# Altium project MainBoard.PrjPCB
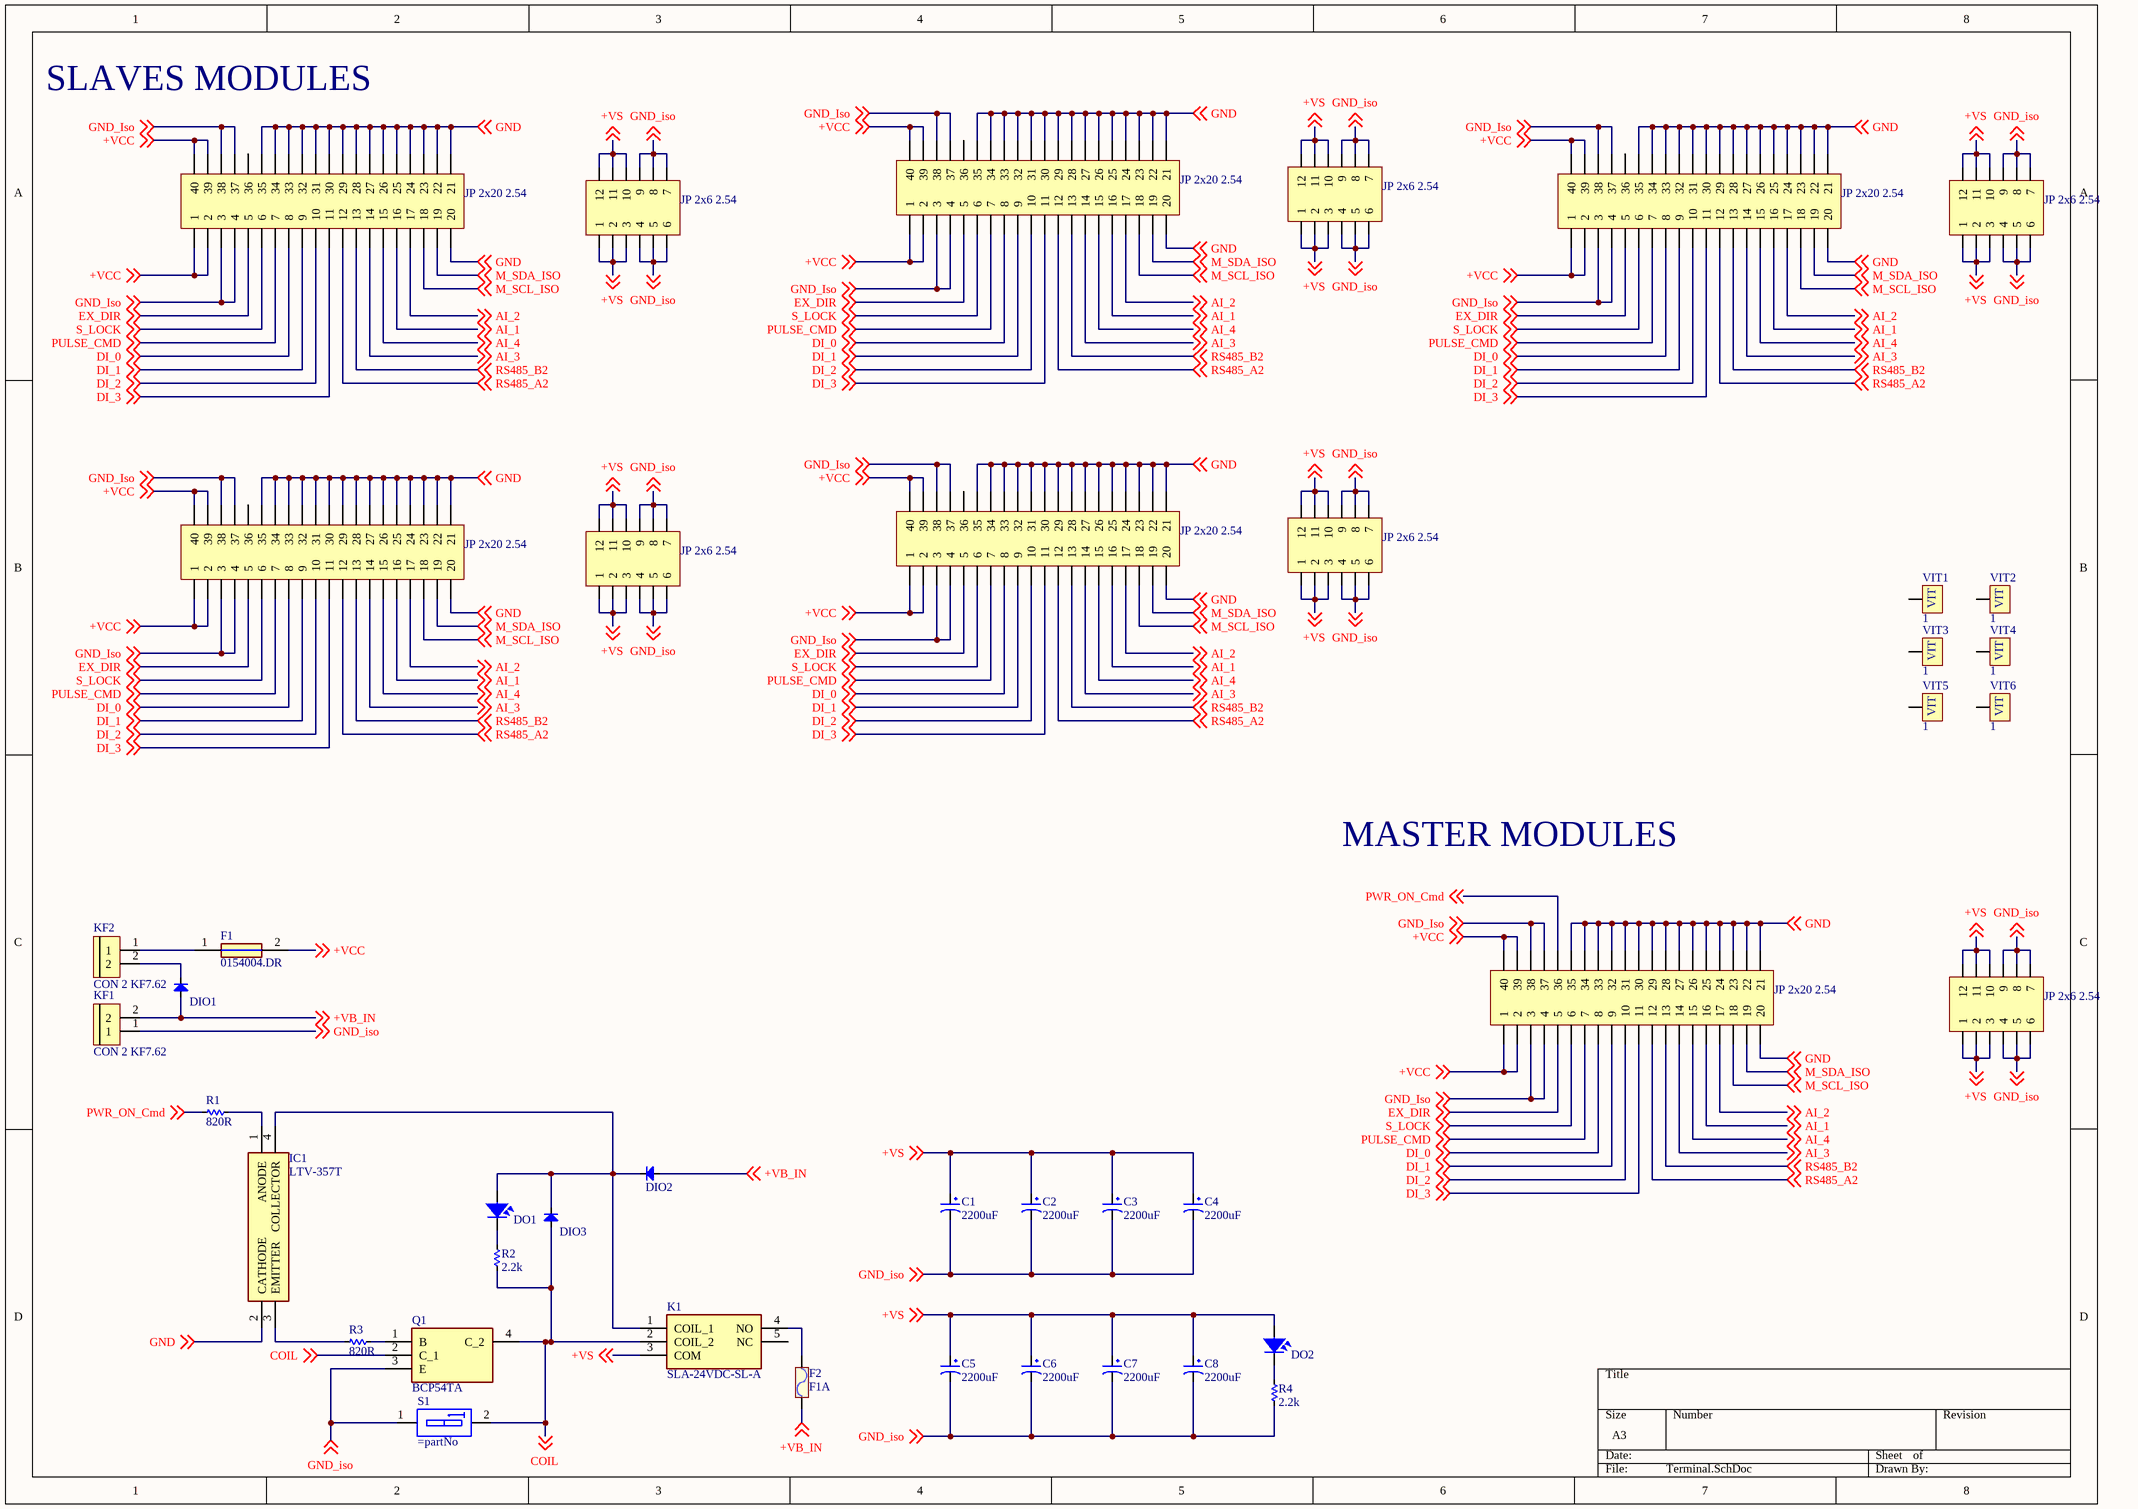
[diagram p0: Terminal.SchDoc]
1 sheet, 43 parts. Net scope: global (net labels, ports and power ports of the same name join across sheets).
Board file: PCB_Mainboard.PcbDoc

## Sheet Terminal.SchDoc
size A3

### Parts
C1  2200uF  [tu hoa 16mm]
C2  2200uF  [tu hoa 16mm]
C3  2200uF  [tu hoa 16mm]
C4  2200uF  [tu hoa 16mm]
C5  2200uF  [tu hoa 16mm]
C6  2200uF  [tu hoa 16mm]
C7  2200uF  [tu hoa 16mm]
C8  2200uF  [tu hoa 16mm]
DIO1  Diode SMD  [DIO-SMD-106]  (value not drawn)
DIO2  Diode SMD  [DIO-SMD-106]  (value not drawn)
DIO3  Diode SMD  [DIO-SMD-106]  (value not drawn)
DO1  LED  [LED-0805-Yellow]  (value not drawn)
DO2  LED  [LED-0805-Yellow]  (value not drawn)
F1  0154004.DR  [0154001.DRT]
F2  F1A  [Fuse1]
IC1  LTV-357T  [LTV-357T]
JP1  JP 2x20 2.54  [JP 2x20 CT]
JP2  JP 2x6 2.54  [JP 2x6 CT]
JP3  JP 2x20 2.54  [JP 2x20 CT]
JP4  JP 2x6 2.54  [JP 2x6 CT]
JP5  JP 2x20 2.54  [JP 2x20 CT]
JP6  JP 2x6 2.54  [JP 2x6 CT]
JP7  JP 2x20 2.54  [JP 2x20 CT]
JP9  JP 2x20 2.54  [JP 2x20 CT]
JP10  JP 2x6 2.54  [JP 2x6 CT]
JP11  JP 2x20 2.54  [JP 2x20 CT]
JP12  JP 2x6 2.54  [JP 2x6 CT]
JP?  JP 2x6 2.54  [JP 2x6 CT]
K1  SLA-24VDC-SL-A  [SLA24VDCSLA]
KF1  CON 2 KF7.62  [CON 2 KF7.62]
KF2  CON 2 KF7.62  [CON 2 KF7.62]
Q1  BCP54TA  [SOT230P700X165-4N]
R1  820R  [RES-SMD-0805]
R2  2.2k  [RES-SMD-0805]
R3  820R  [RES-SMD-0805]
R4  2.2k  [RES-SMD-0805]
S1  (no value)  [SW-DIP1-1]
VIT1  1  [VIT]
VIT2  1  [VIT]
VIT3  1  [VIT]
VIT4  1  [VIT]
VIT5  1  [VIT]
VIT6  1  [VIT]

### Nets
+VB_IN: DIO1.1(A) DIO2.1(A) F2.1 KF1.2 ; off-sheet +VB_IN
+VCC: F1.2 JP1.1 JP1.2 JP1.39 JP1.40 JP3.1 JP3.2 JP3.39 JP3.40 JP5.1 JP5.2 JP5.39 JP5.40 JP7.1 JP7.2 JP7.39 JP7.40 JP9.1 JP9.2 JP9.39 JP9.40 JP11.1 JP11.2 JP11.39 JP11.40 ; off-sheet +VCC
+VS: C1.1 C2.1 C3.1 C4.1 C5.1 C6.1 C7.1 C8.1 DO2.1 JP2.1 JP2.2 JP2.3 JP2.10 JP2.11 JP2.12 JP4.1 JP4.2 JP4.3 JP4.10 JP4.11 JP4.12 JP6.1 JP6.2 JP6.3 JP6.10 JP6.11 JP6.12 JP10.1 JP10.2 JP10.3 JP10.10 JP10.11 JP10.12 JP12.1 JP12.2 JP12.3 JP12.10 JP12.11 JP12.12 JP?.1 JP?.2 JP?.3 JP?.10 JP?.11 JP?.12 K1.3(COM) ; off-sheet +VS
AI_1: JP1.16 JP3.16 JP5.16 JP7.16 JP9.16 JP11.16 ; off-sheet AI_1
AI_2: JP1.17 JP3.17 JP5.17 JP7.17 JP9.17 JP11.17 ; off-sheet AI_2
AI_3: JP1.14 JP3.14 JP5.14 JP7.14 JP9.14 JP11.14 ; off-sheet AI_3
AI_4: JP1.15 JP3.15 JP5.15 JP7.15 JP9.15 JP11.15 ; off-sheet AI_4
COIL: DIO3.1(A) K1.2(COIL_2) Q1.2(C_1) Q1.4(C_2) R2.2 S1.2 ; off-sheet COIL
DI_0: JP1.8 JP3.8 JP5.8 JP7.8 JP9.8 JP11.8 ; off-sheet DI_0
DI_1: JP1.9 JP3.9 JP5.9 JP7.9 JP9.9 JP11.9 ; off-sheet DI_1
DI_2: JP1.10 JP3.10 JP5.10 JP7.10 JP9.10 JP11.10 ; off-sheet DI_2
DI_3: JP1.11 JP3.11 JP5.11 JP7.11 JP9.11 JP11.11 ; off-sheet DI_3
EX_DIR: JP1.5 JP3.5 JP5.5 JP7.5 JP9.5 JP11.5 ; off-sheet EX_DIR
GND: IC1.2(CATHODE) JP1.20 JP1.21 JP1.22 JP1.23 JP1.24 JP1.25 JP1.26 JP1.27 JP1.28 JP1.29 JP1.30 JP1.31 JP1.32 JP1.33 JP1.34 JP1.35 JP3.20 JP3.21 JP3.22 JP3.23 JP3.24 JP3.25 JP3.26 JP3.27 JP3.28 JP3.29 JP3.30 JP3.31 JP3.32 JP3.33 JP3.34 JP3.35 JP5.20 JP5.21 JP5.22 JP5.23 JP5.24 JP5.25 JP5.26 JP5.27 JP5.28 JP5.29 JP5.30 JP5.31 JP5.32 JP5.33 JP5.34 JP5.35 JP7.20 JP7.21 JP7.22 JP7.23 JP7.24 JP7.25 JP7.26 JP7.27 JP7.28 JP7.29 JP7.30 JP7.31 JP7.32 JP7.33 JP7.34 JP7.35 JP9.20 JP9.21 JP9.22 JP9.23 JP9.24 JP9.25 JP9.26 JP9.27 JP9.28 JP9.29 JP9.30 JP9.31 JP9.32 JP9.33 JP9.34 JP9.35 JP11.20 JP11.21 JP11.22 JP11.23 JP11.24 JP11.25 JP11.26 JP11.27 JP11.28 JP11.29 JP11.30 JP11.31 JP11.32 JP11.33 JP11.34 JP11.35 ; off-sheet GND
GND_iso: C1.2 C2.2 C3.2 C4.2 C5.2 C6.2 C7.2 C8.2 JP1.3 JP1.4 JP1.37 JP1.38 JP2.4 JP2.5 JP2.6 JP2.7 JP2.8 JP2.9 JP3.3 JP3.4 JP3.37 JP3.38 JP4.4 JP4.5 JP4.6 JP4.7 JP4.8 JP4.9 JP5.3 JP5.4 JP5.37 JP5.38 JP6.4 JP6.5 JP6.6 JP6.7 JP6.8 JP6.9 JP7.3 JP7.4 JP7.37 JP7.38 JP9.3 JP9.4 JP9.37 JP9.38 JP10.4 JP10.5 JP10.6 JP10.7 JP10.8 JP10.9 JP11.3 JP11.4 JP11.37 JP11.38 JP12.4 JP12.5 JP12.6 JP12.7 JP12.8 JP12.9 JP?.4 JP?.5 JP?.6 JP?.7 JP?.8 JP?.9 KF1.1 Q1.3(E) R4.2 S1.1 ; off-sheet GND_iso, off-sheet GND_Iso
M_SCL_ISO: JP1.18 JP3.18 JP5.18 JP7.18 JP9.18 JP11.18 ; off-sheet M_SCL_ISO
M_SDA_ISO: JP1.19 JP3.19 JP5.19 JP7.19 JP9.19 JP11.19 ; off-sheet M_SDA_ISO
PULSE_CMD: JP1.7 JP3.7 JP5.7 JP7.7 JP9.7 JP11.7 ; off-sheet PULSE_CMD
PWR_ON_Cmd: JP9.36 R1.2 ; off-sheet PWR_ON_Cmd
RS485_A2: JP1.12 JP3.12 JP5.12 JP7.12 JP9.12 JP11.12 ; off-sheet RS485_A2
RS485_B2: JP1.13 JP3.13 JP5.13 JP7.13 JP9.13 JP11.13 ; off-sheet RS485_B2
S_LOCK: JP1.6 JP3.6 JP5.6 JP7.6 JP9.6 JP11.6 ; off-sheet S_LOCK
NetDIO1_2: DIO1.2(K) KF2.2
NetDIO2_2: DIO2.2(K) DIO3.2(K) DO1.1 IC1.4(COLLECTOR) K1.1(COIL_1)
NetDO1_2: DO1.2 R2.1
NetDO2_2: DO2.2 R4.1
NetF1_1: F1.1 KF2.1
NetF2_2: F2.2 K1.4(NO)
NetIC1_1: IC1.1(ANODE) R1.1
NetIC1_3: IC1.3(EMITTER) R3.2
NetQ1_1: Q1.1(B) R3.1

Not connected (* = marked no-connect by the designer): JP1 36; JP3 36; JP5 36; JP7 36; JP11 36; K1 5(NC); VIT1 VIT1(1); VIT2 VIT1(1); VIT3 VIT1(1); VIT4 VIT1(1); VIT5 VIT1(1); VIT6 VIT1(1)

### Notes on the sheet
- SLAVES MODULES
- MASTER MODULES

### Library data of the parts
C1-C8 = Tu Hoa 2200uF 35V 16x25: Cắm; Don_Vi: Con; So_Chan: 2; Ten_Linh_Kien: Tụ Hóa 2200uF 35V 16x25MM; Ma_Hang: MH004420; Chung_Loai: Cắm; Kieu_Chan: *
DIO1-DIO3 = Diode SMD: Default Diode; Code - JEDEC: DO-214-AB; Value: 1N5007; Published: 8-Jun-2000; Revision: July-2002: Re-released for DXP Platform.; Publisher: Altium Limited
DO1 DO2 = LED SMD: Value: LED 3 - 5 ly 2 Colour
F1 = 0154004.DR: Fuse; Manufacturer_Name: LITTELFUSE; Datasheet Link: http://m.littelfuse.com/~/media/electronics/datasheets/fuses/littelfuse_fuse_154_154t_154l_154tl_datasheet.pdf.pdf; Manufacturer_Part_Number: 0154004.DR; Mouser Part Number: 576-0154004.DR; Mouser Price/Stock: https://www.mouser.co.uk/ProductDetail/Littelfuse/0154004.DR?qs=gu7KAQ731UQeedYeniUNnQ%3D%3D; Arrow Part Number: 0154004.DR; Arrow Price/Stock: https://www.arrow.com/en/products/0154004.dr/littelfuse?region=nac
F2 = Fuse: Designed by: VanDungEvn; Value: Fuse
IC1 = LTV-357T: Integrated Circuit; Manufacturer_Name: Lite-On; Datasheet Link: http://uk.rs-online.com/web/p/products/6912088; Manufacturer_Part_Number: LTV-357T; Mouser Part Number: 859-LTV-357T; Mouser Price/Stock: https://www.mouser.co.uk/ProductDetail/Lite-On/LTV-357T?qs=IhlP1sn3qi5zhJzi4zUCwQ%3D%3D; Arrow Part Number: LTV-357T; Arrow Price/Stock: https://www.arrow.com/en/products/ltv-357t/lite-on-technology?region=nac
JP1 JP3 JP5 JP7 JP9 JP11 = JP 2x20 2.54 Cai Thang: Cắm; Ten_Linh_Kien: Jump Đôi Cái 2.54MM 2x20P Thẳng; Don_Vi: Con; Ma_Hang: MH008647; Ghi_Chu: *; Kieu_Chan: *; Chung_Loai: Cắm
JP2 JP4 JP6 JP10 JP12 JP? = JP 2x6 2.54 Cai Thang: Cắm; Ten_Linh_Kien: Jump Đôi Cái 2.54MM 2x20P Thẳng; Don_Vi: Con; Ma_Hang: MH008647; Ghi_Chu: *; Kieu_Chan: *; Chung_Loai: Cắm
K1 = SLA-24VDC-SL-A: Relay or Contactor; Manufacturer_Name: Songle Relay; Datasheet Link: https://datasheet.lcsc.com/szlcsc/1811200040_Ningbo-Songle-Relay-SLA-24VDC-SL-A_C80812.pdf; Height: 20.4mm; Manufacturer_Part_Number: SLA-24VDC-SL-A
KF1 KF2 = CON 2 KF7.62: Cắm; Ma_Hang: MH002053; Ten_Linh_Kien: CON 2 KF7.62-2P 7.62MM (Đen Thẳng); Chung_Loai: Cắm; Ghi_Chu: *; Kieu_Chan: *; Don_Vi: Con
Q1 = BCP54TA: Transistor BJT NPN; Manufacturer_Name: Diodes Inc.; Datasheet Link: https://www.diodes.com/assets/Datasheets/BCP54_55_56.pdf; Height: 1.65mm; Manufacturer_Part_Number: BCP54TA; Mouser Part Number: 522-BCP54TA; Mouser Price/Stock: https://www.mouser.co.uk/ProductDetail/Diodes-Incorporated/BCP54TA?qs=fKsNvYl5pt81P4xkpCoZ4w%3D%3D; Arrow Part Number: BCP54TA; Arrow Price/Stock: https://www.arrow.com/en/products/bcp54ta/diodes-incorporated?region=nac
R1-R4 = Res-SMD: Resistor; Manufacturer: Generic Components; Class: Passive; Published: 08/06/2000; Publisher: Altium Hobart Technology Centre
S1 = SWDIP1: WS-DITV 2.54 mm small compact THT flat actuator with top tape; Manufacturer: Wurth Elektronik; Part No.: 418127160901; ComponentLink1 Description: Manufacturer; ComponentLink2 Description: Datasheet; Pole: 01; Created Date: Dec.2015; ComponentLink1URL: http://www.we-online.com; ComponentLink2URL: http://katalog.we-online.de/em/datasheet/4181271609xx.pdf; Created by: Baojun Chen
VIT1-VIT6 = VIT: Oc Vit